# EAGLE design usbtinyisp-singleside-r1 (EAGLE 5.12)
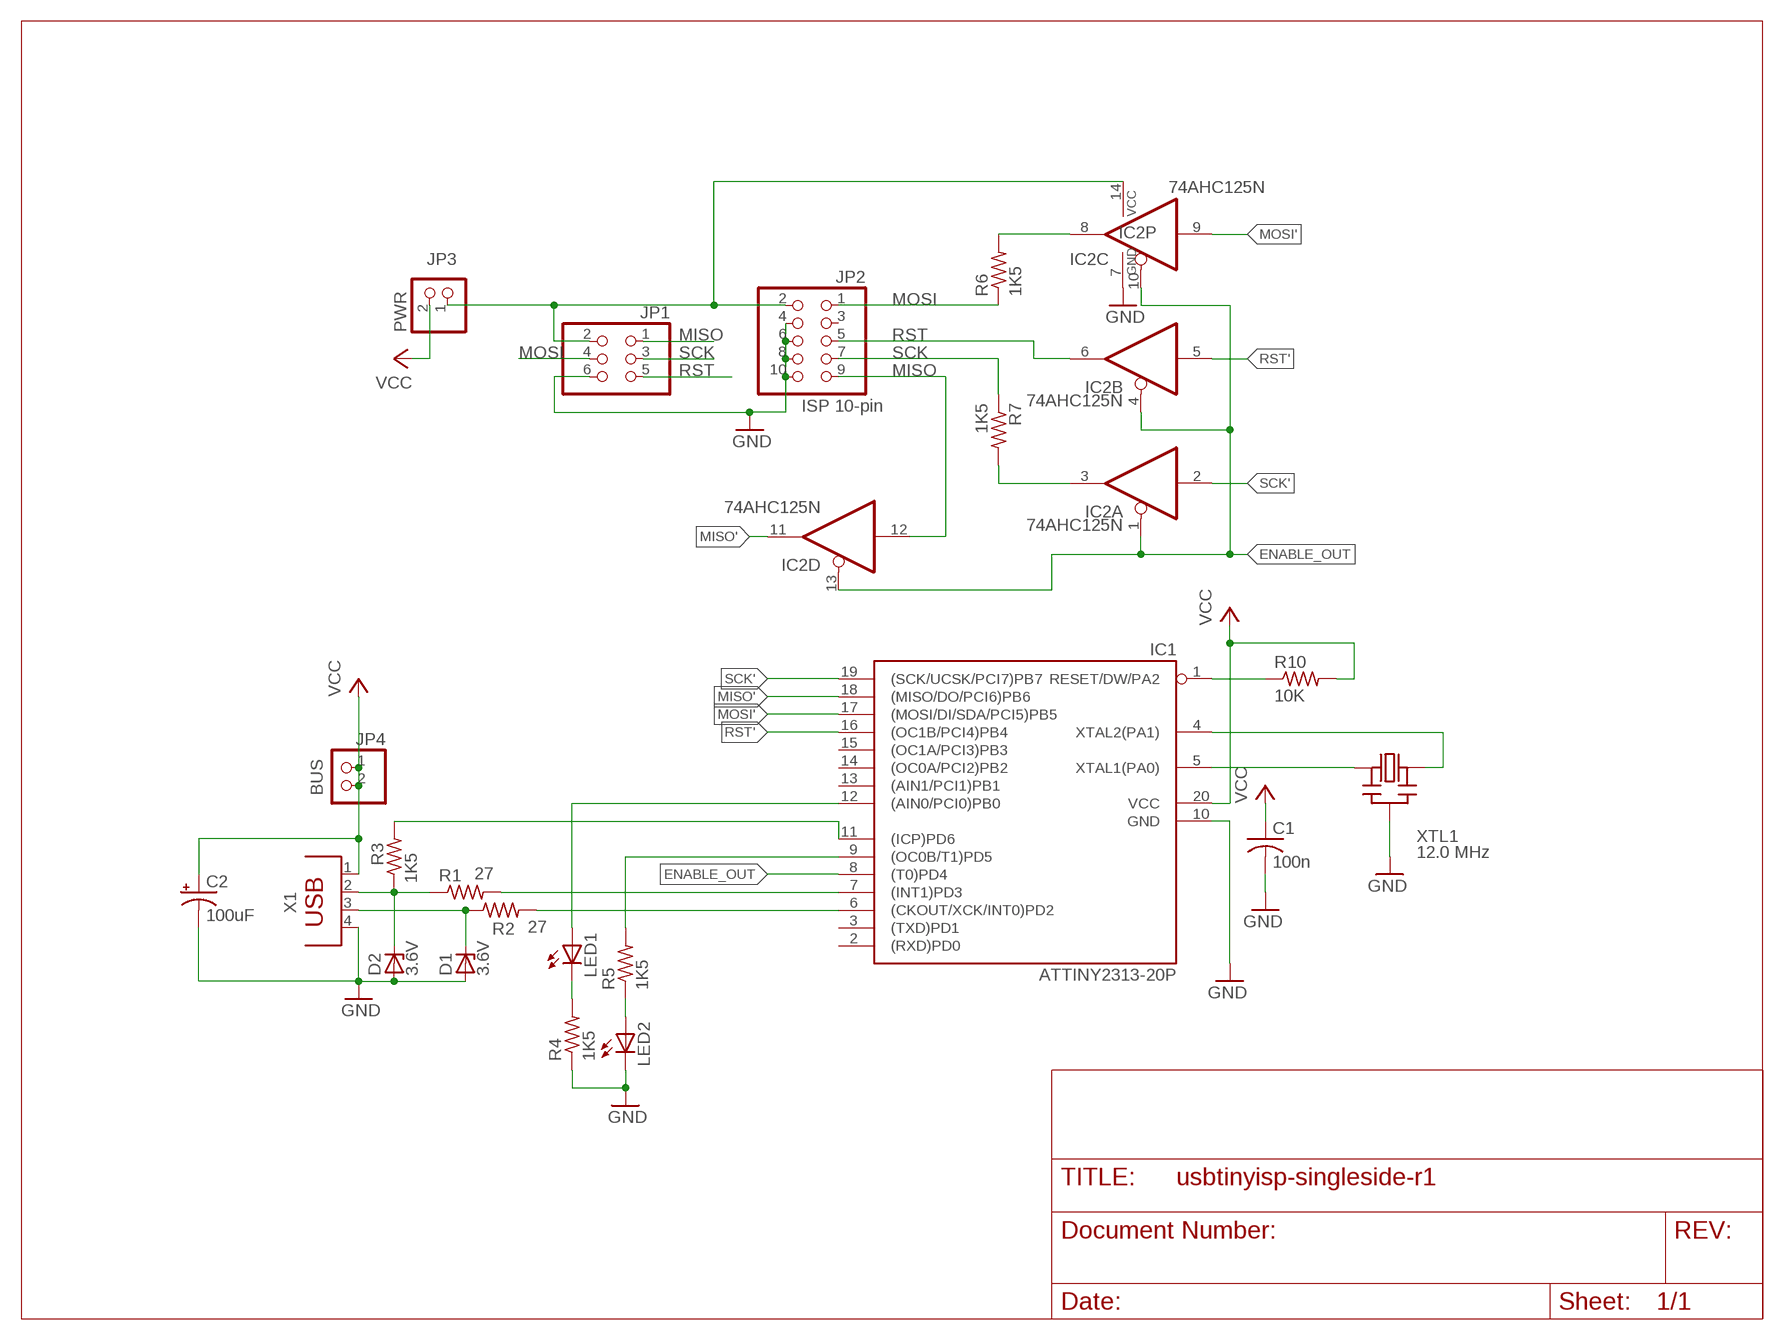
[diagram p0: schematic, sheet 1]

## Parts
C1  100n  C-US050-025X075  [C050-025X075]
C2  100uF  CPOL-USE2.5-5  [E2,5-5]
D1  3.6V  ZENER-DIODEDO35Z10  [DO35Z10]
D2  3.6V  ZENER-DIODEDO35Z10  [DO35Z10]
IC1  ATTINY2313-20P  [DIL20]
IC2  74AHC125N  74HC125N  [DIL14]
JP1  PINHD-2X3  [2X03]
JP2  ISP 10-pin  PINHD-2X5  [2X05]
JP3  PWR  PINHD-1X2  [1X02]
JP4  BUS  PINHD-1X2  [1X02]
LED1  LED3MM  [LED3MM]
LED2  LED3MM  [LED3MM]
R1  27  R-US_0207/10  [0207/10]
R2  27  R-US_0207/10  [0207/10]
R3  1K5  R-US_0207/10  [0207/10]
R4  1K5  R-US_0207/10  [0207/10]
R5  1K5  R-US_0207/10  [0207/10]
R6  1K5  R-US_0207/10  [0207/10]
R7  1K5  R-US_0207/5V  [0207/5V]
R10  10K  R-US_0207/10  [0207/10]
X1  PN61729  [PN61729]
XTL1  12.0 MHz  CERMOSCILL  [CERM_OSC]

## Nets
ENABLE_OUT: IC1.8((T0)PD4) IC2.1(A:OE) IC2.4(B:OE) IC2.10(C:OE) IC2.13(D:OE)
GND: C1.2 C2.- D1.A D2.A IC1.10(GND) IC2.7(P:GND) JP1.6 JP2.4 JP2.6 JP2.8 JP2.10 LED2.K(C) R4.1 X1.4 XTL1.P$2(GND)
MISO: IC2.12(D:I) JP1.1 JP2.9
MISO': IC1.18((MISO/DO/PCI6)PB6) IC2.11(D:O)
MOSI: JP1.4 JP2.1 R6.1
MOSI': IC1.17((MOSI/DI/SDA/PCI5)PB5) IC2.9(C:I)
N$1: D2.C R1.1 R3.1 X1.2
N$2: D1.C R2.1 X1.3
N$3: IC1.7((INT1)PD3) R1.2
N$4: IC1.5(XTAL1(PA0)) XTL1.P$3(OUT)
N$5: IC1.4(XTAL2(PA1)) XTL1.P$1(IN)
N$6: IC1.6((CKOUT/XCK/INT0)PD2) R2.2
N$7: IC1.12((AIN0/PCI0)PB0) LED1.A
N$8: LED1.K(C) R4.2
N$9: IC1.1(RESET/DW/PA2) R10.1
N$10: IC1.9((OC0B/T1)PD5) R5.2
N$11: LED2.A R5.1
N$12: IC2.3(A:O) R7.2
N$13: IC2.8(C:O) R6.2
N$14: IC2.14(P:VCC) JP1.2 JP2.2 JP3.1
N$16: IC1.11((ICP)PD6) R3.2
RST: IC2.6(B:O) JP1.5 JP2.5
RST': IC1.16((OC1B/PCI4)PB4) IC2.5(B:I)
SCK: JP1.3 JP2.7 R7.1
SCK': IC1.19((SCK/UCSK/PCI7)PB7) IC2.2(A:I)
VCC: C1.1 C2.+ IC1.20(VCC) JP3.2 JP4.1 JP4.2 R10.2 X1.1
Unconnected: IC1.2((RXD)PD0) IC1.3((TXD)PD1) IC1.13((AIN1/PCI1)PB1) IC1.14((OC0A/PCI2)PB2) IC1.15((OC1A/PCI3)PB3) JP2.3

## Library data of the parts
C1 = rcl-ez:C-US: CAPACITOR, American symbol
C2 = rcl-ez:CPOL-US: POLARIZED CAPACITOR, American symbol
D1 D2 = diode:ZENER-DIODE: Z-Diode
IC1 = avr:ATTINY2313: MICROCONTROLLER 2 Kbytes FLASH 128 bytes SRAM 128 bytes EEPROM USART USI
IC2 = 74xx-eu:74*125: Quad bus BUFFER, 3-state
JP1 = pinhead-ez:PINHD-2X3: PIN HEADER
JP2 = sonar:PINHD-2X5: PIN HEADER
JP3 JP4 = pinhead:PINHD-1X2: PIN HEADER
LED1 LED2 = minimidi:LED: LED OSRAM: - CHIPLED LG R971, LG N971, LY N971, LG Q971, LY Q971, LO R971, LY R971 LH N974, LH R974 LS Q976, LO Q976, LY Q976 LO Q996 - Hyper CHIPLED LW Q18S LB Q993, LB Q99A, LB R99A - SideLED LS A670, LO A670, LY A670, LG A670, LP A670 LB A673, LV A673, LT A673, LW A673 LH A674 LY A675 LS A676, LA A676, LO A676, LY A676, LW A676 LS A679, LY A679, LG A679 - Hyper Micro SIDELED® LS Y876, LA Y876, LO Y876, LY Y876 LT Y87S - SmartLED LW L88C, LW L88S LB L89C, LB L89S, LG L890 LS L89K, LO L89K, LY L89K LS L896, LA L896, LO L896, LY L896 - TOPLED LS T670, LO T670, LY T670, LG T670, LP T670 LSG T670, LSP T670, LSY T670, LOP T670, LYG T670 LG T671, LOG T671, LSG T671 LB T673, LV T673, LT T673, LW T673 LH T674 LS T676, LA T676, LO T676, LY T676, LB T676, LH T676, LSB T676, LW T676 LB T67C, LV T67C, LT T67C, LS T67K, LO T67K, LY T67K, LW E67C LS E67B, LA E67B, LO E67B, LY E67B, LB E67C, LV E67C, LT E67C LW T67C LS T679, LY T679, LG T679 LS T770, LO T770, LY T770, LG T770, LP T770 LB T773, LV T773, LT T773, LW T773 LH T774 LS E675, LA E675, LY E675, LS T675 LS T776, LA T776, LO T776, LY T776, LB T776 LHGB T686 LT T68C, LB T68C - Hyper Mini TOPLED® LB M676 - Mini TOPLED Santana® LG M470 LS M47K, LO M47K, LY M47K Source: http://www.osram.convergy.de/
R1-R7 R10 = rcl-ez:R-US_: RESISTOR, American symbol
X1 = con-berg-ez:PN61729: BERG USB connector
XTL1 = minimidi:CERMOSCILL

## Board
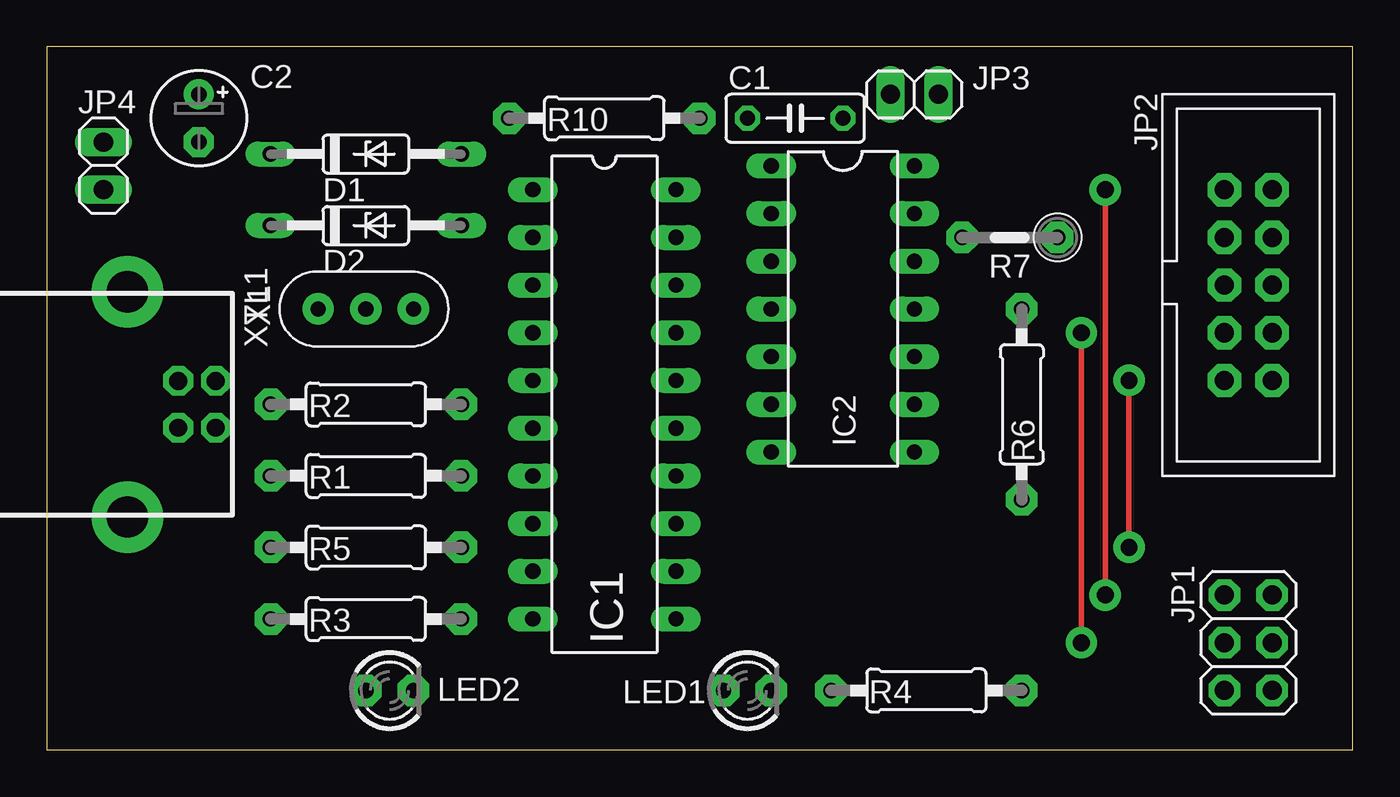
[diagram p1: board, top side]
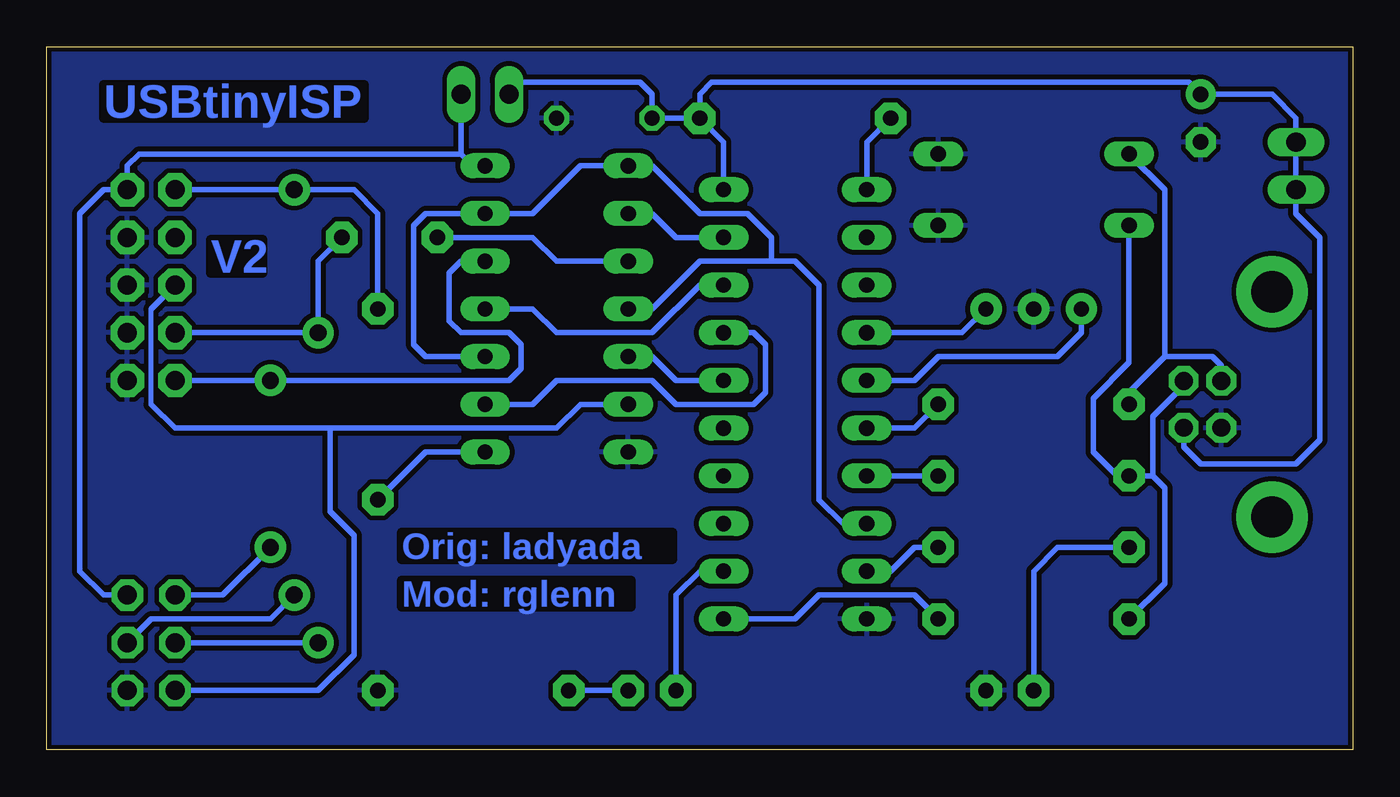
[diagram p2: board, bottom side, seen from below]

Size 69.52 x 37.45 mm. Coordinates in mm from the lower left corner, seen from the top.
Outline: 69.52,0 69.52,37.45 0,37.45 0,0 69.52,0
Copper layers (1*16): Top 0.035mm / dielectric 1.5mm / Bottom 0.035mm
Design rules "default": minimum track width 8mil, minimum drill 24mil, track to track 10mil, track to pad 10mil, pad to pad 10mil, via to via 10mil, smd to smd 10mil, copper to edge 10mil, drill to drill 8mil, minimum pad ring 10mil, minimum via ring 8mil, stop-mask expansion 4mil, vias tented up to drill 0mil, thermal gap 10mil

### Footprints (pad centres in the part's own frame; a part is rotated, then mirrored left to right if it is on the bottom)
C050-025X075 = drill 0.813 octagon: 1 -2.54,0; 2 2.54,0
E2,5-5 = drill 0.813 pad 1.6 round: + -1.27,0 | drill 0.813 pad 1.6 octagon: - 1.27,0
DO35Z10 = drill 0.813 long: A 5.08,0; C -5.08,0
DIL20 = drill 0.813 long: 1 -11.43,-3.81; 2 -8.89,-3.81; 3 -6.35,-3.81; 4 -3.81,-3.81; 5 -1.27,-3.81; 6 1.27,-3.81; 7 3.81,-3.81; 8 6.35,-3.81; 9 8.89,-3.81; 10 11.43,-3.81; 11 11.43,3.81; 12 8.89,3.81; 13 6.35,3.81; 14 3.81,3.81; 15 1.27,3.81; 16 -1.27,3.81; 17 -3.81,3.81; 18 -6.35,3.81; 19 -8.89,3.81; 20 -11.43,3.81
DIL14 = drill 0.813 long: 1 -7.62,-3.81; 2 -5.08,-3.81; 3 -2.54,-3.81; 4 0,-3.81; 5 2.54,-3.81; 6 5.08,-3.81; 7 7.62,-3.81; 8 7.62,3.81; 9 5.08,3.81; 10 2.54,3.81; 11 0,3.81; 12 -2.54,3.81; 13 -5.08,3.81; 14 -7.62,3.81
2X03 = drill 1.016 pad 1.676 octagon: 1 -2.54,-1.27; 2 -2.54,1.27; 3 0,-1.27; 4 0,1.27; 5 2.54,-1.27; 6 2.54,1.27
2X05 = drill 1.016 pad 1.778 octagon: 1 -5.08,-1.27; 2 -5.08,1.27; 3 -2.54,-1.27; 4 -2.54,1.27; 5 0,-1.27; 6 0,1.27; 7 2.54,-1.27; 8 2.54,1.27; 9 5.08,-1.27; 10 5.08,1.27
1X02 = drill 1.016 long: 1 -1.27,0; 2 1.27,0
LED3MM = drill 0.813 pad 1.676 octagon: A -1.27,0; K 1.27,0
0207/10 = drill 0.813 pad 1.676 octagon: 1 -5.08,0; 2 5.08,0
0207/5V = drill 0.813 pad 1.676 octagon: 1 -2.54,0; 2 2.54,0
PN61729 = drill 0.95 pad 1.575 octagon: 1 1.25,4.71; 2 -1.25,4.71; 3 -1.25,2.71; 4 1.25,2.71 | drill 2.2 pad 3.81 round: P$1 -6,0; P$2 6,0
CERM_OSC = drill 0.813 pad 1.676 round: P$1 -2.54,0; P$2 0,0; P$3 2.54,0

### Placement (x,y rotation side)
C1  39.84,33.65 0 top
C2  8.09,33.65 270 top
D1  16.98,31.75 0 top
D2  16.98,27.94 0 top
IC1  29.68,18.41 270 top
IC2  42.38,23.49 270 top
JP1  63.97,5.71 270 top
JP2  63.97,24.76 270 top
JP3  46.19,34.92 180 top
JP4  3.01,31.11 270 top
LED1  37.3,3.17 0 top
LED2  18.25,3.17 0 top
R1  16.98,14.6 0 top
R2  16.98,18.41 0 top
R3  16.98,6.98 0 top
R4  46.83,3.17 180 top
R5  16.98,10.79 0 top
R6  51.91,18.41 270 top
R7  51.27,27.3 180 top
R10  29.68,33.65 0 top
X1  4.28,18.41 270 top
XTL1  16.98,23.49 180 top

### Tracks (layer width: path | path; a pad name or v marks a point on that pad's centre or on a via)
ENABLE_OUT
  Bottom 0.305: 30.95,26.03 34.76,26.03 37.3,23.49 IC2.4 | 30.95,26.03 29.68,26.03 28.41,24.76 28.41,13.33 27.14,12.06 IC1.8 | 30.95,26.03 30.95,27.3 32.22,28.57 34.76,28.57 37.3,31.11 IC2.1 41.11,31.11 43.65,28.57 IC2.13 49.37,28.57 50,27.94 50,21.59 49.37,20.95 IC2.10
GND
  pour Bottom: -0.8,38.73 -0.8,-0.64 70.32,-0.64 70.32,38.73
MISO  (via drill 0.9 pad 1.68)
  Top 0.305: v57.62,19.68 v57.62,10.79
  Bottom 0.305: JP2.9 v57.62,19.68 44.92,19.68 44.29,20.32 44.29,21.59 44.92,22.22 47.46,22.22 48.09,22.86 48.09,25.39 47.46,26.03 IC2.12 | JP1.1 60.16,8.25 v57.62,10.79
MISO'
  Bottom 0.305: IC1.18 34.76,24.76 37.3,22.22 42.38,22.22 43.65,23.49 IC2.11
MOSI  (via drill 0.9 pad 1.68)
  Top 0.305: v56.35,8.25 v56.35,29.84
  Bottom 0.305: R6.1 51.91,28.57 53.18,29.84 v56.35,29.84 JP2.1 | JP1.4 63.97,6.98 57.62,6.98 v56.35,8.25
MOSI'
  Bottom 0.305: IC2.9 43.65,18.41 42.38,19.68 37.3,19.68 36.03,18.41 31.9,18.41 31.27,19.05 31.27,21.59 31.9,22.22 IC1.17
N$1
  Bottom 0.305: R3.1 10,8.88 10,13.96 10.63,14.6 | 10.63,14.6 R1.1 12.54,14.6 13.81,15.87 13.81,18.73 11.9,20.63 D2.C | 10.63,14.6 10.63,17.78 8.99,19.42 X1.2
N$2
  Bottom 0.305: D1.C 10,29.84 10,20.95 | 10,20.95 11.9,19.05 R2.1 | X1.3 6.99,20.48 7.46,20.95 10,20.95
N$3
  Bottom 0.305: R1.2 IC1.7
N$4
  Bottom 0.305: XTL1.P$3 14.44,22.22 15.71,20.95 22.06,20.95 23.33,19.68 IC1.5
N$5
  Bottom 0.305: XTL1.P$1 20.79,22.22 IC1.4
N$6
  Bottom 0.305: IC1.6 23.33,17.14 R2.2
N$7
  Bottom 0.305: LED1.A 36.03,8.25 34.76,9.52 IC1.12
N$8
  Bottom 0.305: LED1.K R4.2
N$9
  Bottom 0.305: IC1.1 25.87,32.38 R10.1
N$10
  Bottom 0.305: IC1.9 24.6,9.52 23.33,10.79 R5.2
N$11
  Bottom 0.305: LED2.A 16.98,9.52 15.71,10.79 R5.1
N$12
  Bottom 0.305: R7.2 43.65,27.3 42.38,26.03 IC2.3
N$13
  Bottom 0.305: R6.2 49.37,15.87 IC2.8
N$14
  Bottom 0.305: JP1.2 66.51,8.25 67.78,9.52 67.78,28.57 66.51,29.84 JP2.2 65.24,31.11 64.6,31.75 47.46,31.75 | 47.46,31.75 46.83,31.11 IC2.14 | 47.46,31.75 JP3.1
N$16
  Bottom 0.305: R3.2 23.33,8.25 28.41,8.25 29.68,6.98 IC1.11
RST
  Bottom 0.254: 63.97,18.41 63.97,23.49
  Bottom 0.305: IC2.6 41.11,18.41 42.38,17.14 54.45,17.14 | 54.45,17.14 62.7,17.14 63.97,18.41 | 63.97,23.49 JP2.5 | JP1.5 55.08,3.17 53.18,5.08 53.18,11.42 54.45,12.69 54.45,17.14
RST'
  Bottom 0.305: IC1.16 36.03,19.68 37.3,20.95 IC2.5
SCK  (via drill 0.9 pad 1.68)
  Top 0.305: v55.08,5.71 v55.08,22.22
  Bottom 0.305: JP2.7 v55.08,22.22 55.08,26.03 R7.1 | v55.08,5.71 JP1.3
SCK'
  Bottom 0.305: IC1.19 36.03,27.3 37.3,28.57 IC2.2
VCC
  Bottom 0.305: IC1.20 33.49,32.38 R10.2 | JP3.2 44.92,35.55 37.94,35.55 37.3,34.92 C1.1 R10.2 | R10.2 34.76,34.92 34.12,35.55 8.73,35.55 C2.+ 4.28,34.92 3.01,33.65 JP4.1 JP4.2 3.01,28.57 1.74,27.3 1.74,16.51 3.01,15.23 8.09,15.23 8.99,16.14 X1.1

### Text on the board
Bottom: USBtinyISP | V2 | Orig: ladyada | Mod: rglenn